# EAGLE schematic MB_LAUNCHPAD (EAGLE 6.4)
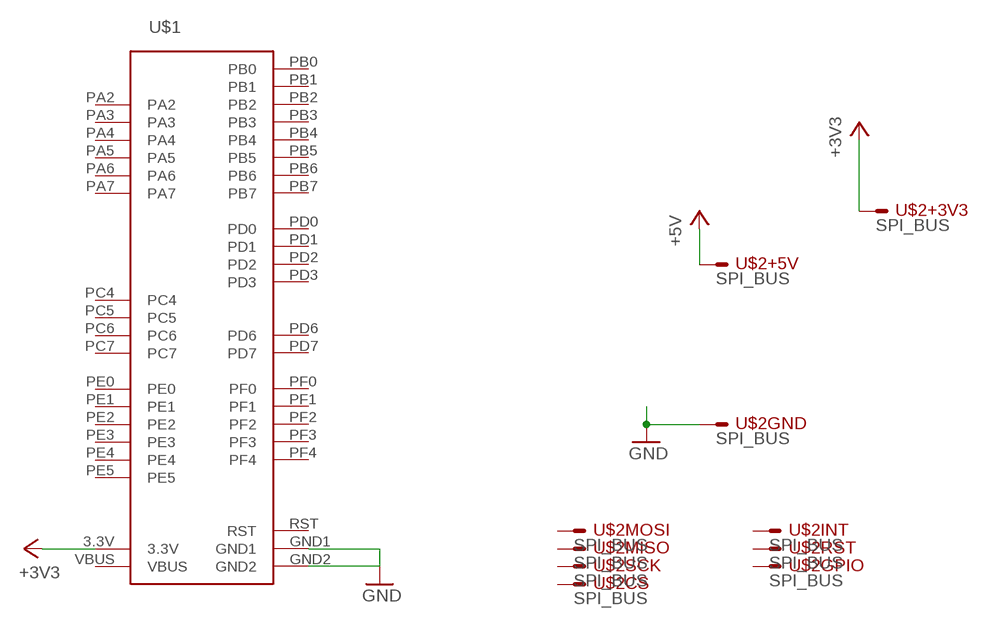
[diagram p0: schematic, sheet 1]

## Parts
U$1  STELLARIS-LAUNCHPADSTELLARIS-LAUNCHPAD-XL  [LAUNCHPAD-XL]
U$2  SPI_BUS  [SPI_BUS]

## Nets
+3V3: U$1.3.3V
+5V: U$2.+5V
GND: U$1.GND1 U$2.GND
Unconnected: U$1.PA2 U$1.PA3 U$1.PA4 U$1.PA5 U$1.PA6 U$1.PA7 U$1.PB0 U$1.PB1 U$1.PB2 U$1.PB3 U$1.PB4 U$1.PB5 U$1.PB6 U$1.PB7 U$1.PC4 U$1.PC5 U$1.PC6 U$1.PC7 U$1.PD0 U$1.PD1 U$1.PD2 U$1.PD3 U$1.PD6 U$1.PD7 U$1.PE0 U$1.PE1 U$1.PE2 U$1.PE3 U$1.PE4 U$1.PE5 U$1.PF0 U$1.PF1 U$1.PF2 U$1.PF3 U$1.PF4 U$2.+3V3 U$2.CS U$2.GPIO U$2.INT U$2.MISO U$2.MOSI U$2.RST U$2.SCK

## Power pins joined to a net without a drawn wire
GND2: U$1.GND2
RST: U$1.RST
VBUS: U$1.VBUS

## Library data of the parts
U$1 = StellarisLaunchPad_Fred:STELLARIS-LAUNCHPAD
U$2 = lieven:SPI_BUS